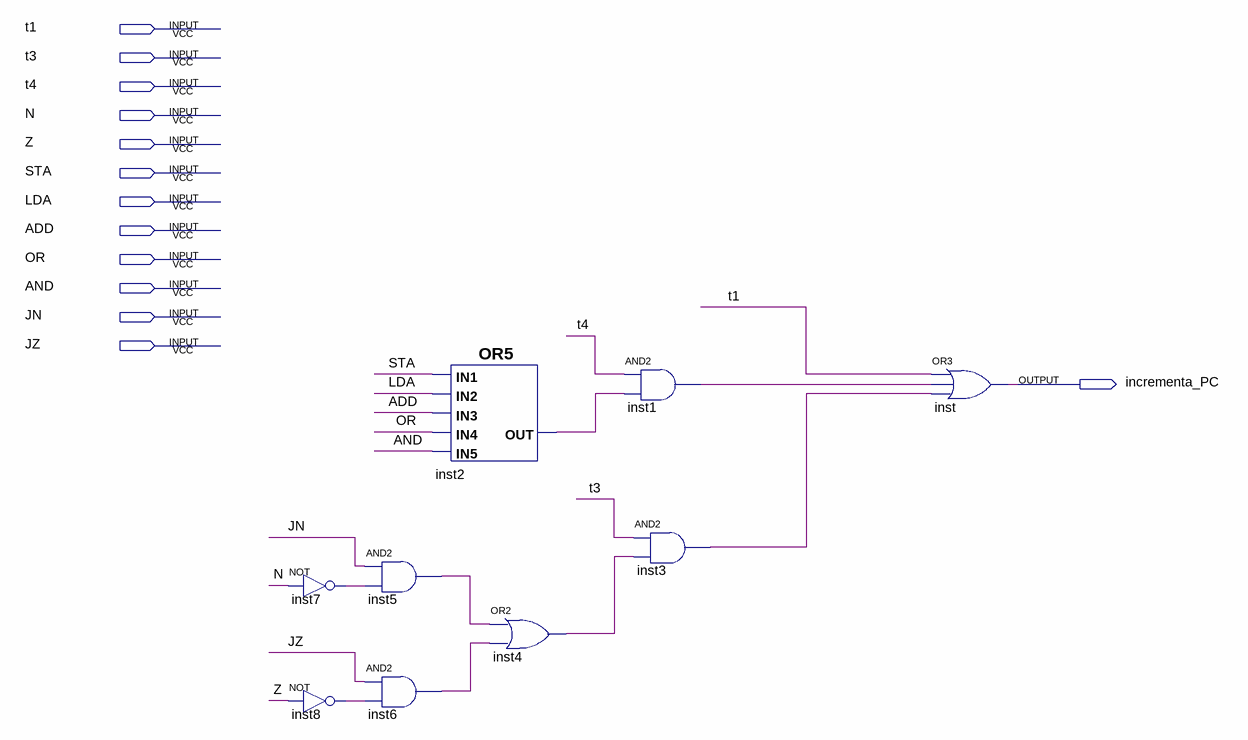
[diagram p0: schematic sheet]
// Quartus schematic incrementa_PC.bdf as structural Verilog: 9 symbols, 13 pins
module incrementa_PC (
  input  t1,
  input  t3,
  input  t4,
  input  N,
  input  Z,
  input  STA,
  input  LDA,
  input  ADD,
  input  OR,
  input  AND,
  input  JN,
  input  JZ,
  output incrementa_PC
);

  wire inst1_out, inst2_out, inst3_out, inst4_out, inst5_out, inst6_out, inst7_out, inst8_out;

  not inst7 (inst7_out, N);
  not inst8 (inst8_out, Z);
  and inst5 (inst5_out, JN, inst7_out);
  and inst6 (inst6_out, JZ, inst8_out);
  or inst2 (inst2_out, STA, LDA, ADD, OR, AND);
  or inst4 (inst4_out, inst5_out, inst6_out);
  and inst1 (inst1_out, t4, inst2_out);
  and inst3 (inst3_out, t3, inst4_out);
  or inst (incrementa_PC, t1, inst1_out, inst3_out);
endmodule
